# Altium schematic sheet Microcontroller.SchDoc
size A4; SheetNumber: 4; SheetTotal: 9
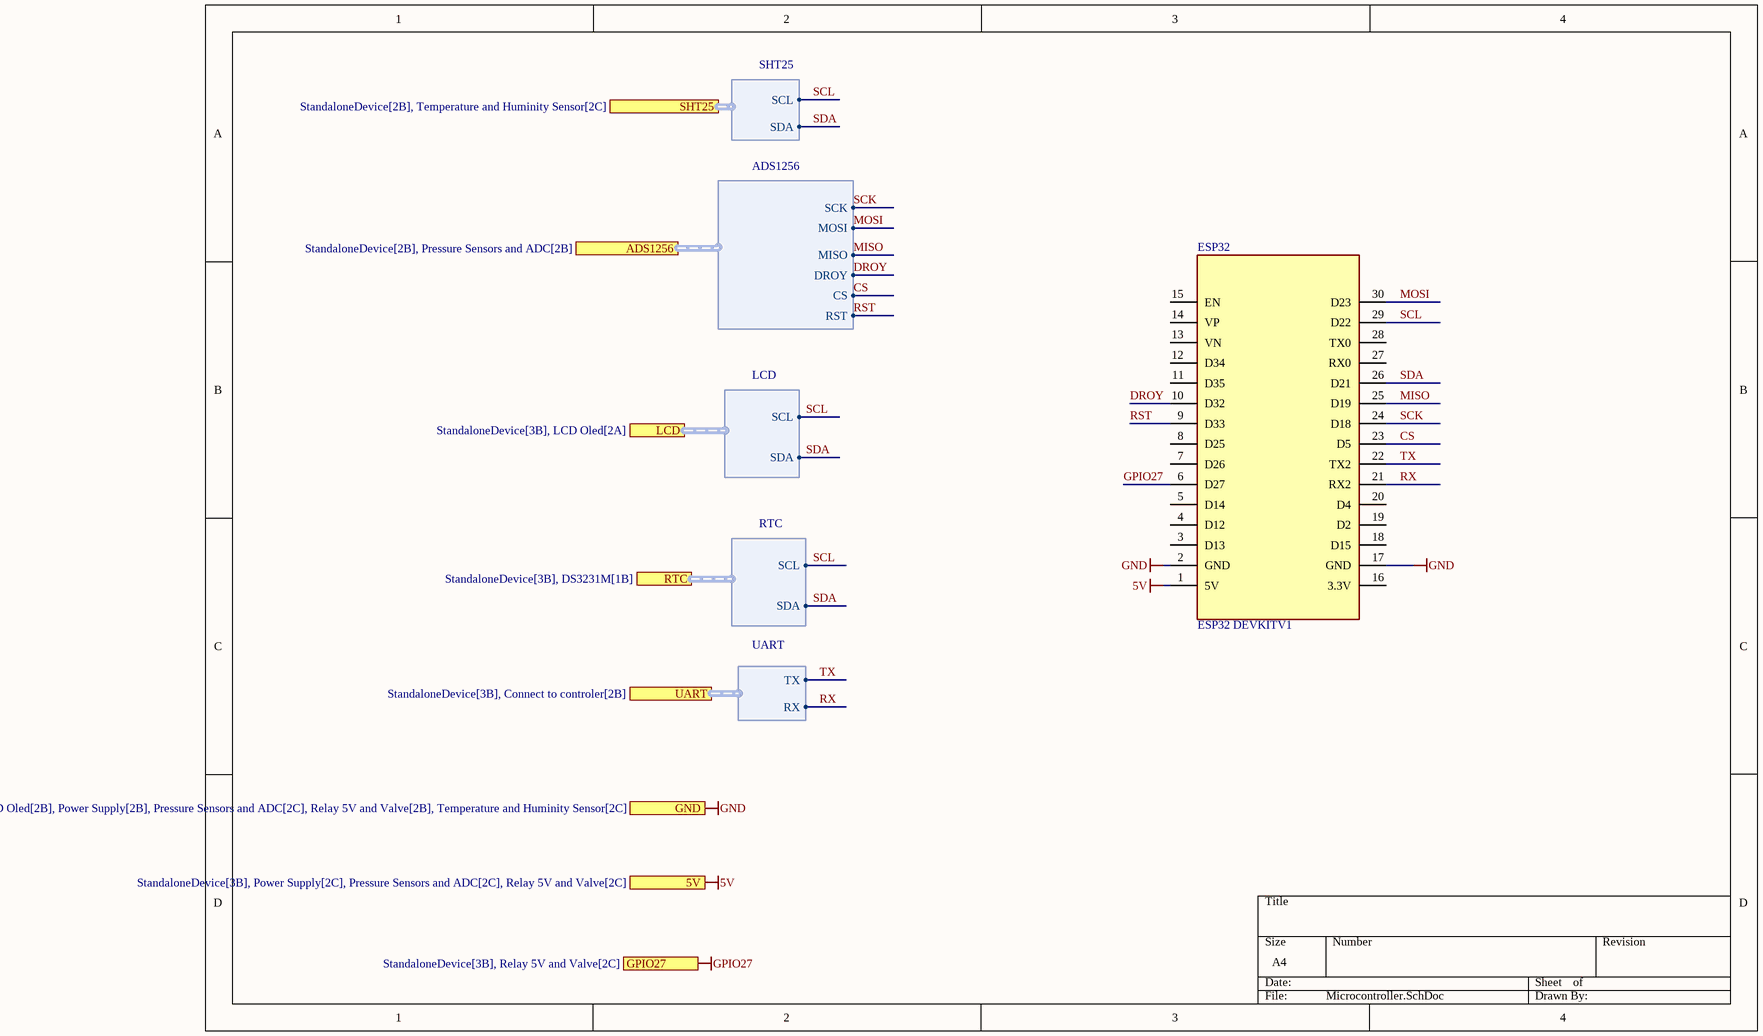
[diagram p0: Microcontroller.SchDoc]

## Parts
ESP32  ESP32 DEVKITV1  [ESP32 DEVKITV1]

## Ports
5V (see StandaloneDevice[3B], Power Supply[2C], Pressure Sensors and ADC[2C], Relay 5V and Valve[2C]), ADS1256 (harness ADS1256, see StandaloneDevice[2B], Pressure Sensors and ADC[2B]), GND (see StandaloneDevice[3B], DS3231M[2B], LCD Oled[2B], Power Supply[2B], Pressure Sensors and ADC[2C], Relay 5V and Valve[2B], Temperature and Huminity Sensor[2C]), GPIO27 (see StandaloneDevice[3B], Relay 5V and Valve[2C]), LCD (harness LCD, see StandaloneDevice[3B], LCD Oled[2A]), RTC (harness RTC, see StandaloneDevice[3B], DS3231M[1B]), SHT25 (harness SHT25, see StandaloneDevice[2B], Temperature and Huminity Sensor[2C]), UART (harness UART, see StandaloneDevice[3B], Connect to controler[2B])

## Harnesses
SHT25: SCL, SDA
ADS1256: SCK, MOSI, MISO, DROY, CS, RST
LCD: SCL, SDA
RTC: SCL, SDA
UART: TX, RX

## Nets
5V: ESP32.1(5V) ; port 5V
GND: ESP32.2(GND) ESP32.17(GND) ; port GND
GPIO27: ESP32.6(D27) ; port GPIO27
CS: ESP32.23(D5) ; port ADS1256.CS
DROY: ESP32.10(D32) ; port ADS1256.DROY
MISO: ESP32.25(D19) ; port ADS1256.MISO
MOSI: ESP32.30(D23) ; port ADS1256.MOSI
RST: ESP32.9(D33) ; port ADS1256.RST
RX: ESP32.21(RX2) ; port UART.RX
SCK: ESP32.24(D18) ; port ADS1256.SCK
SCL: ESP32.29(D22) ; port SHT25.SCL, port LCD.SCL, port RTC.SCL
SDA: ESP32.26(D21) ; port SHT25.SDA, port LCD.SDA, port RTC.SDA
TX: ESP32.22(TX2) ; port UART.TX

Not connected (* = marked no-connect by the designer): ESP32 3(D13) 4(D12) 5(D14) 7(D26) 8(D25) 11(D35) 12(D34) 13(VN) 14(VP) 15(EN) 16(3.3V) 18(D15) 19(D2) 20(D4) 27(RX0) 28(TX0)

## Library data of the parts
ESP32 = ESP32 DEVKITV1: MF: Espressif Systems; MP: ESP32 NODEMCU; SnapEDA_Link: https://www.snapeda.com/parts/ESP32%20NODEMCU/Espressif+Systems/view-part/?ref=snap; Package: Package; Value: *; Check_prices: https://www.snapeda.com/parts/ESP32%20NODEMCU/Espressif+Systems/view-part/?ref=eda